# EAGLE design ERobot Minimalis - 2023 (EAGLE 9.6.2)
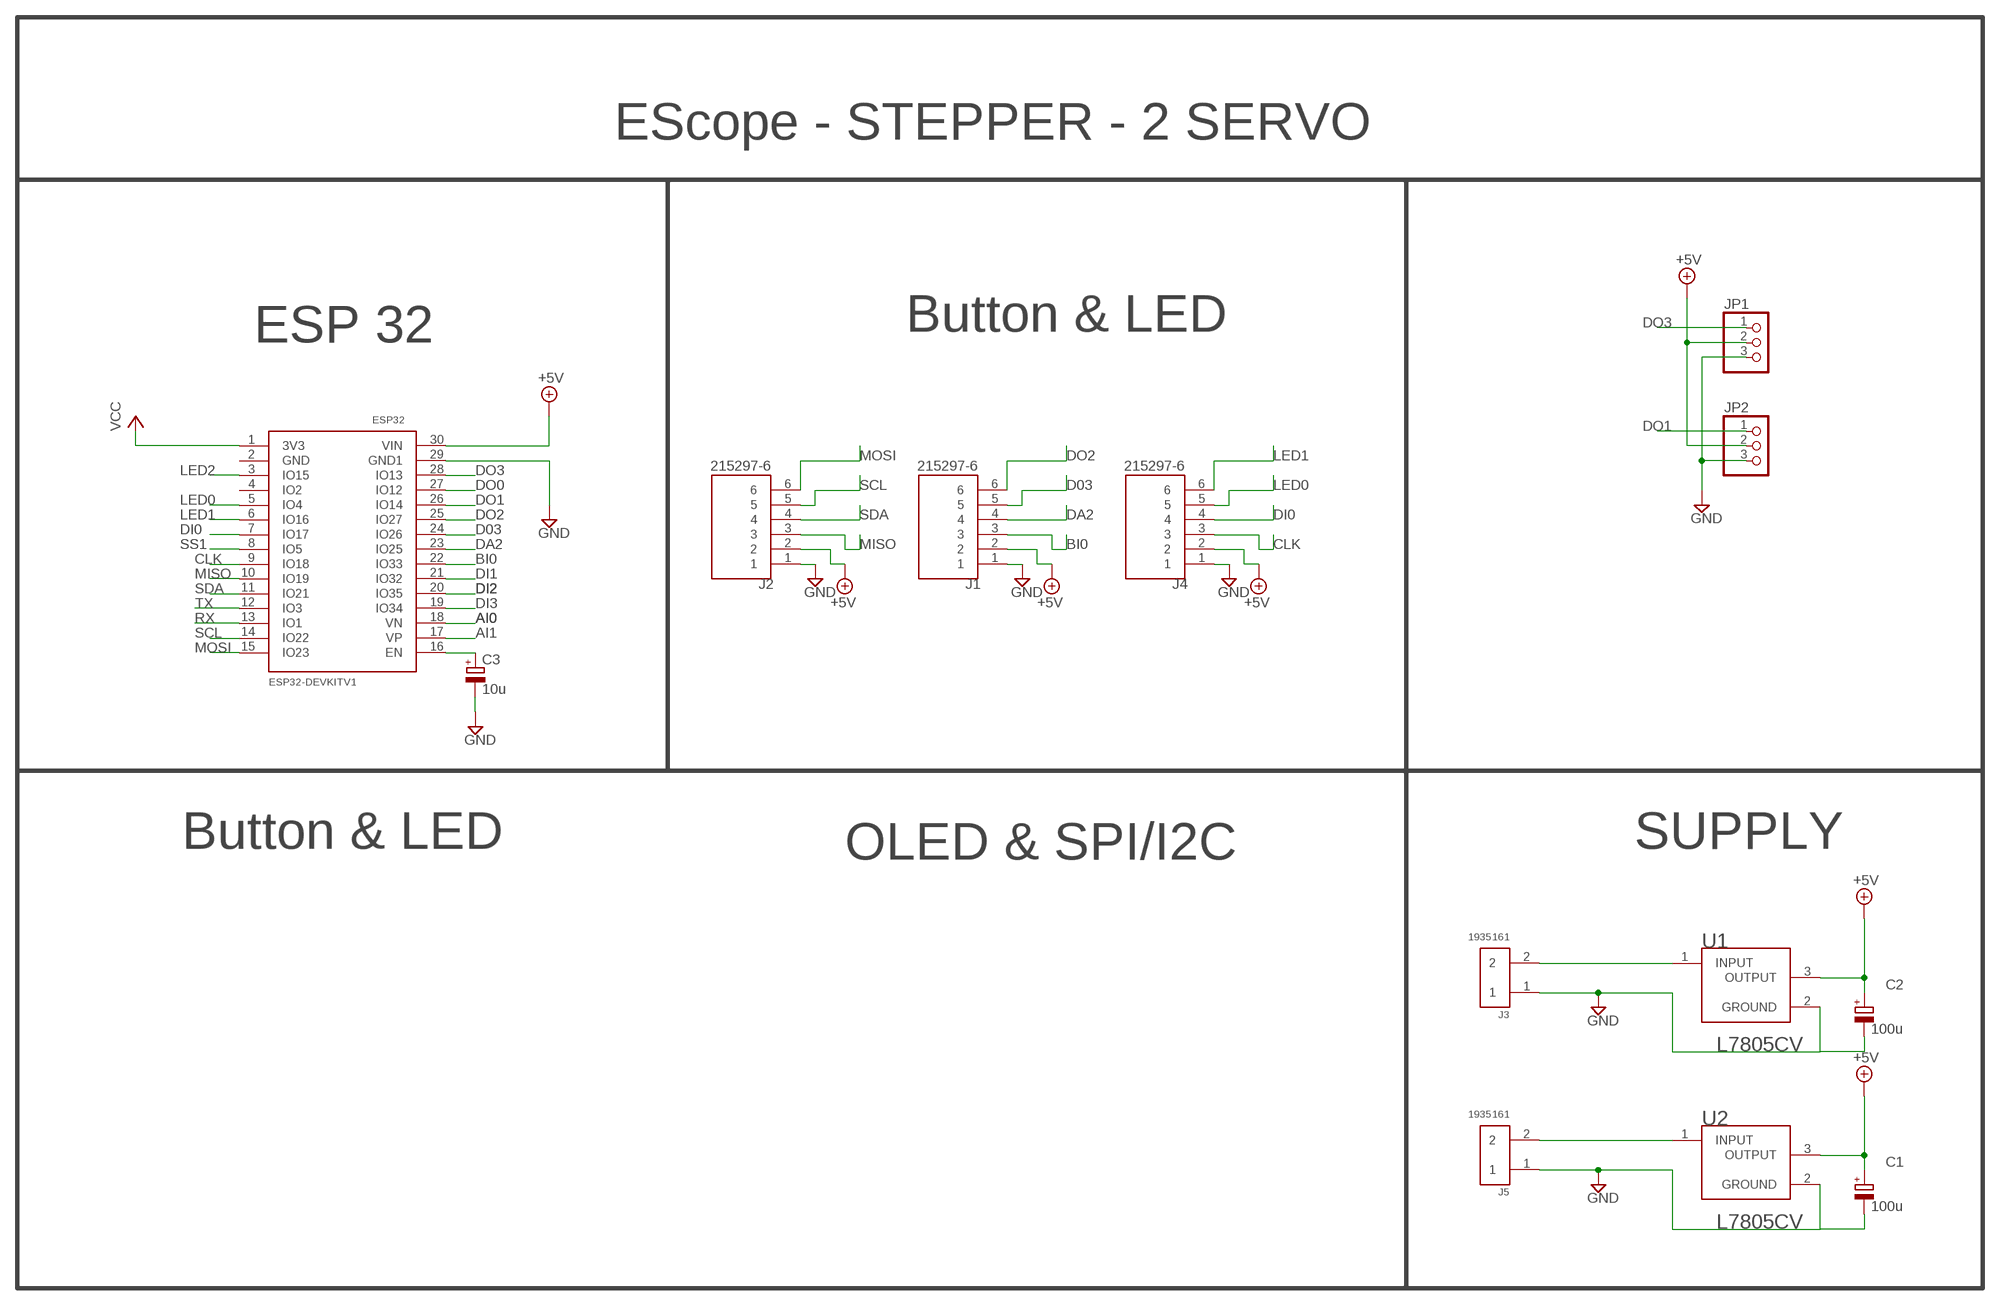
[diagram p0: schematic, sheet 1]

## Parts
C1  100u  CPOL-EUE3.5-8  [E3,5-8]
C2  100u  CPOL-EUE3.5-8  [E3,5-8]
C3  10u  CPOL-EUE2.5-5  [E2,5-5]
ESP32  DEVKIT-V1  ESP32DEVKITV1  [ESP32-DEVKITV1]
J1  215297-6  [TE_215297-6]
J2  215297-6  [TE_215297-6]
J3  1935161  [PHOENIX_1935161]
J4  215297-6  [TE_215297-6]
J5  1935161  [PHOENIX_1935161]
JP1  PINHD-1X3  [1X03]
JP2  PINHD-1X3  [1X03]
U1  STMICROELECTRONICS_L7805CVSTMICROELECTRONICS_L7805CV_0_0  [STMICROELECTRONICS_L7805CV_0]
U2  STMICROELECTRONICS_L7805CVSTMICROELECTRONICS_L7805CV_0_0  [STMICROELECTRONICS_L7805CV_0]

## Nets
+5V: C1.+ C2.+ ESP32.30(VIN) J1.2 J2.2 J4.2 JP1.2 JP2.2 U1.3(OUTPUT) U2.3(OUTPUT)
AI0: ESP32.18(VN)
AI1: ESP32.17(VP)
BI0: ESP32.22(IO33) J1.3
CLK: ESP32.9(IO18) J4.3
D03: ESP32.24(IO26) J1.5
DA2: ESP32.23(IO25) J1.4
DI0: ESP32.7(IO17) J4.4
DI1: ESP32.21(IO32)
DI2: ESP32.20(IO35)
DI3: ESP32.19(IO34)
DO0: ESP32.27(IO12)
DO1: ESP32.26(IO14) JP2.1
DO2: ESP32.25(IO27) J1.6
DO3: ESP32.28(IO13) JP1.1
GND: C1.- C2.- C3.- ESP32.29(GND1) J1.1 J2.1 J3.1 J4.1 J5.1 JP1.3 JP2.3 U1.2(GROUND) U2.2(GROUND)
LED0: ESP32.5(IO4) J4.5
LED1: ESP32.6(IO16) J4.6
LED2: ESP32.3(IO15)
MISO: ESP32.10(IO19) J2.3
MOSI: ESP32.15(IO23) J2.6
N$1: J5.2 U2.1(INPUT)
N$2: J3.2 U1.1(INPUT)
N$4: C3.+ ESP32.16(EN)
RX: ESP32.13(IO1)
SCL: ESP32.14(IO22) J2.5
SDA: ESP32.11(IO21) J2.4
SS1: ESP32.8(IO5)
TX: ESP32.12(IO3)
VCC: ESP32.1(3V3)
Unconnected: ESP32.2(GND) ESP32.4(IO2)

## Notes on the sheet
- EScope - STEPPER - 2 SERVO
- Button & LED
- ESP 32
- Button & LED | SUPPLY
- OLED & SPI/I2C

## Library data of the parts
C1-C3 = rcl:CPOL-EU: POLARIZED CAPACITOR, European symbol; SPICEPREFIX: C
ESP32 = ESP32-DEVKITV1:ESP32DEVKITV1
J1 J2 J4 = 215297-6:215297-6: Check availability <https://pricing.snapeda.com/parts/215297-6/TE%20Connectivity/view-part?ref=eda>; AVAILABILITY: In Stock; COMMENT: 215297-6; DESCRIPTION: Wire-To-Board Connector, Vertical, Ampmodu Hv-100 Series, Through Hole, Receptacle, 6, 2.54 Mm; EU_ROHS_COMPLIANCE: Compliant; MF: TE Connectivity; MP: 215297-6; PACKAGE: None; PRICE: None; PURCHASE-URL: https://pricing.snapeda.com/search/part/215297-6/?ref=eda
J3 J5 = 1935161:1935161: Conn Terminal Blocks 2 POS 5mm Solder ST Thru-Hole 16A Check availability <https://pricing.snapeda.com/parts/1935161/Phoenix%20Contact/view-part?ref=eda>; AVAILABILITY: In Stock; DESCRIPTION: 2 Position Wire to Board Terminal Block Horizontal with Board 0.197 (5.00mm) Through Hole; MF: Phoenix Contact; MP: 1935161; PACKAGE: None; PRICE: None; PURCHASE-URL: https://pricing.snapeda.com/search/part/1935161/?ref=eda
JP1 JP2 = pinhead:PINHD-1X3: PIN HEADER
U1 U2 = STMicroelectronics - L7805CV:STMICROELECTRONICS_L7805CV: Linear Voltage Regulator IC Positive Fixed 1 Output 5V 1.5A TO-220AB; CENTROID_NOT_SPECIFIED: No; DATASHEET: http://www.st.com/content/ccc/resource/technical/document/datasheet/41/4f/b3/b0/12/d4/47/88/CD00000444.pdf/files/CD00000444.pdf/jcr:content/translations/en.CD00000444.pdf; DIGIKEY_DESCRIPTION: IC REG LINEAR 5V 1.5A TO220AB; DIGIKEY_PART_NUMBER: 497-1443-5-ND; IPC_LAND_PATTERN_NAME: TO-220; LEAD_FREE: yes; MF: STMicroelectronics; MFG_PACKAGE_IDENT: TO-220-3; MOUSER_PART_NUMBER: 511-L7805CV; MPN: L7805CV; PACKAGE: TO-220-3; PREFIX: U; ROHS: yes; TEMPERATURE_RANGE_HIGH: +125°C; TEMPERATURE_RANGE_LOW: 0°C

## Board
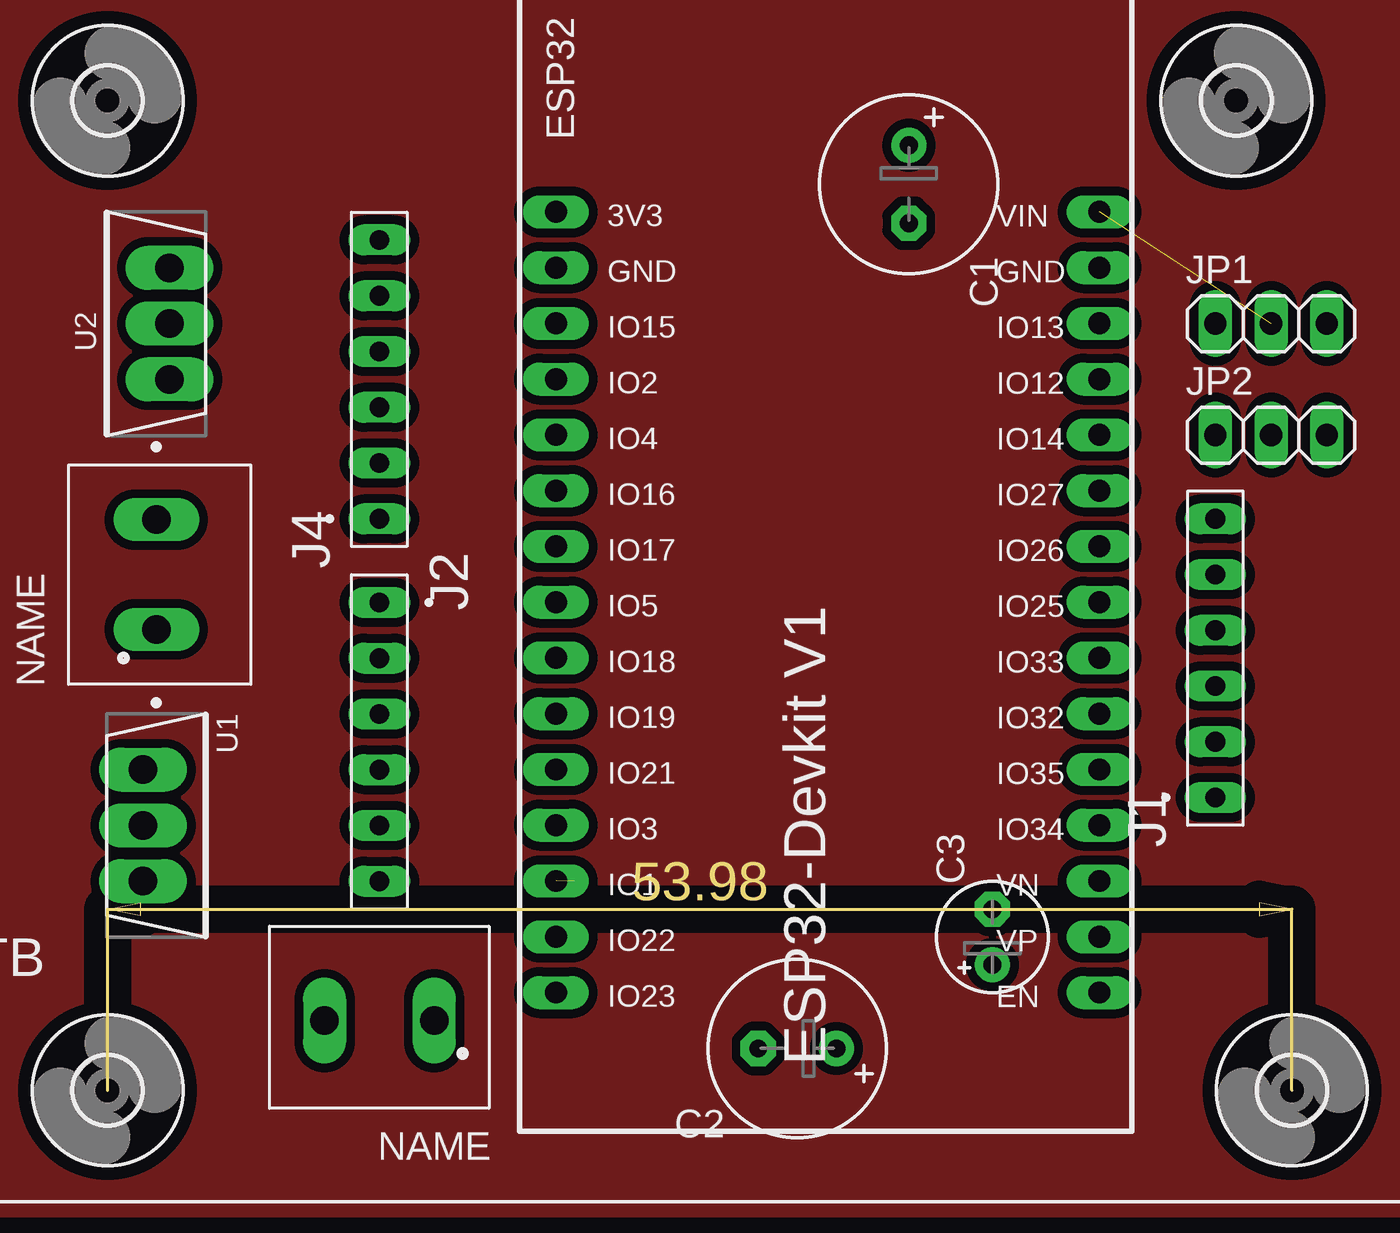
[diagram p1: board, top side]
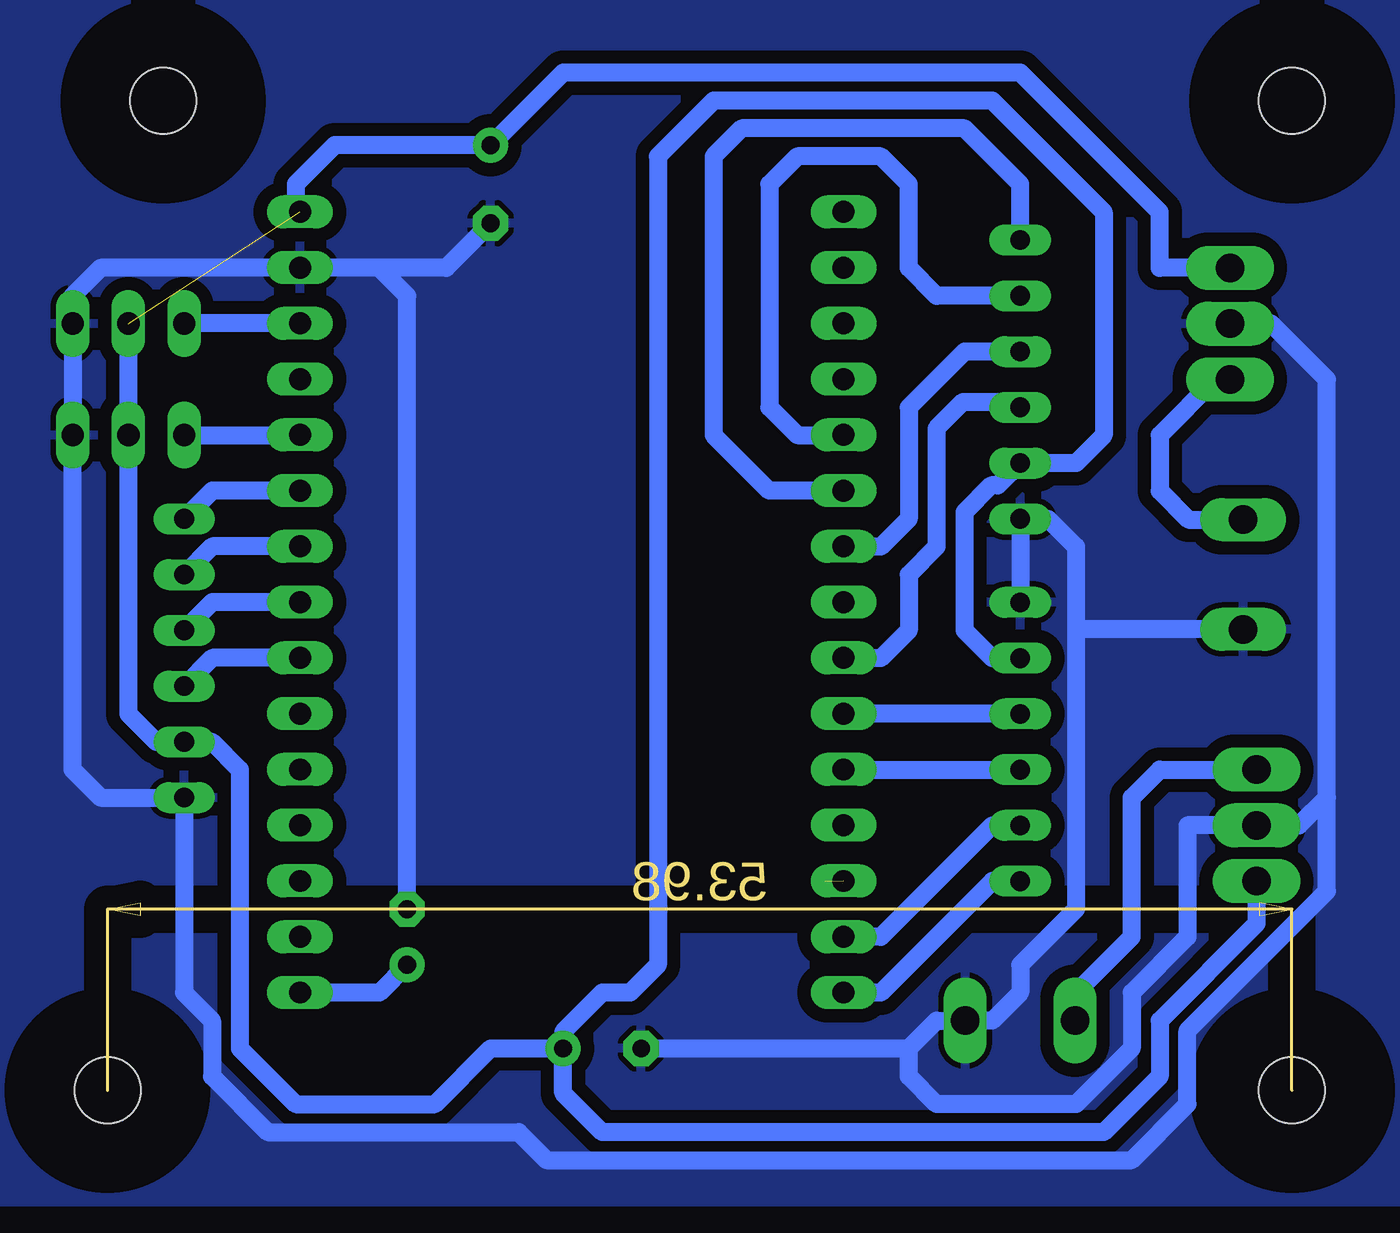
[diagram p2: board, bottom side, seen from below]

Size 53.98 x 8.56 mm. Coordinates in mm from the lower left corner, seen from the top.
Copper layers (1*16): Top 0.035mm / dielectric 1.5mm / Bottom 0.035mm
Design rules "default *": minimum track width 6mil, minimum drill 0.35mm, track to track 16mil, track to pad 16mil, pad to pad 16mil, via to via 16mil, smd to smd 16mil, copper to edge 40mil, drill to drill 6mil, minimum pad ring 10mil, minimum via ring 8mil, stop-mask expansion 4mil, vias tented up to drill 0mil, thermal gap 10mil

### Footprints (pad centres in the part's own frame; a part is rotated, then mirrored left to right if it is on the bottom)
E3,5-8 = drill 0.813 pad 1.6: + -1.778,0 | drill 0.813 pad 1.6 octagon: - 1.778,0
E2,5-5 = drill 0.813 pad 1.6: + -1.27,0 | drill 0.813 pad 1.6 octagon: - 1.27,0
ESP32-DEVKITV1 = drill 1 pad 1.422 long: 1 -22.87,-13.54; 2 -20.33,-13.54; 3 -17.79,-13.54; 4 -15.25,-13.54; 5 -12.71,-13.54; 6 -10.17,-13.54; 7 -7.63,-13.54; 8 -5.09,-13.54; 9 -2.55,-13.54; 10 -0.01,-13.54; 11 2.53,-13.54; 12 5.07,-13.54; 13 7.61,-13.54; 14 10.15,-13.54; 15 12.69,-13.54; 16 12.69,11.23; 17 10.15,11.23; 18 7.61,11.23; 19 5.07,11.23; 20 2.53,11.23; 21 -0.01,11.23; 22 -2.55,11.23; 23 -5.09,11.23; 24 -7.63,11.23; 25 -10.17,11.23; 26 -12.71,11.23; 27 -15.25,11.23; 28 -17.79,11.23; 29 -20.33,11.23; 30 -22.87,11.23
TE_215297-6 = drill 0.9 long: 1 -6.35,0; 2 -3.81,0; 3 -1.27,0; 4 1.27,0; 5 3.81,0; 6 6.35,0
PHOENIX_1935161 = drill 1.3 long: 1 -2.5,0; 2 2.5,0
1X03 = drill 1.016 long: 1 -2.54,0; 2 0,0; 3 2.54,0
STMICROELECTRONICS_L7805CV_0 = drill 1.3 pad 2 long: 1 -0.605,2.54; 2 -0.605,0; 3 -0.605,-2.54
3,0 = hole 3: 0,0

### Placement (x,y rotation side)
C1  36.51,41.28 270 top  (outside the outline)
C2  31.43,1.91 180 top
C3  40.32,6.98 90 top
ESP32  33.97,17.14 270 top
J1  50.48,19.68 90 top  (outside the outline)
J2  12.38,15.88 270 top
J3  12.38,3.18 180 top
J4  12.38,32.39 90 top  (outside the outline)
J5  2.22,23.5 90 top  (outside the outline)
JP1  53.02,34.92 0 top  (outside the outline)
JP2  53.02,29.85 0 top  (outside the outline)
U1  2.22,12.07 0 top
U2  2.22,34.92 180 top  (outside the outline)
U$2  [3,0]  51.44,45.08 0 top  (outside the outline)
U$3  [3,0]  53.98,0 0 top
U$4  [3,0]  0,0 0 top
U$5  [3,0]  0,45.08 0 top  (outside the outline)

### Tracks (layer width: path | path; a pad name or v marks a point on that pad's centre or on a via)
+5V  (1 unrouted)
  Bottom 0.813: J2.2 13.65,19.68 14.92,20.96 14.92,26.34 13.71,27.55 13.41,27.55 J4.2 9.84,28.57 8.57,29.85 8.57,40 13.65,45.08 26.35,45.08 28.89,42.55 28.89,5.71 30.16,4.45 31.43,4.45 33.21,2.67 C2.+ | JP1.2 JP2.2 53.02,17.14 51.75,15.88 J1.2 49.21,15.88 47.94,14.61 47.94,1.91 45.4,-0.63 39.05,-0.63 36.51,1.91 C2.+ | C2.+ 33.21,-0.13 31.43,-1.9 8.57,-1.9 6.03,0.63 6.03,3.18 1.62,7.59 U1.3 | U2.3 6.03,37.47 6.03,40 12.38,46.36 33.21,46.36 C1.+ 43.62,43.05 45.4,41.28 45.4,40.22 ESP32.30
BI0
  Bottom 0.813: ESP32.22 49.2,19.7 J1.3
CLK
  Bottom 0.813: J4.3 12.63,31.36 14.98,31.36 16.19,30.15 16.19,24.77 17.46,23.5 17.46,20.96 18.73,19.68 ESP32.9
D03
  Bottom 0.813: ESP32.24 49.2,24.77 J1.5
DA2
  Bottom 0.813: ESP32.23 49.2,22.23 J1.4
DI0
  Bottom 0.813: J4.4 14.92,33.66 17.46,31.11 17.46,26.04 18.73,24.77 ESP32.7
DO1
  Bottom 0.813: JP2.1 ESP32.26
DO2
  Bottom 0.813: ESP32.25 49.2,27.32 J1.6
DO3
  Bottom 0.813: ESP32.28 JP1.1
GND
  Bottom 0.813: J2.1 J4.1 11.11,26.04 9.84,24.77 9.84,20.96 | 9.84,20.96 9.84,8.26 12.38,5.71 12.38,4.45 13.65,3.18 J3.1 | J3.1 16.19,3.18 17.46,1.91 | 14.92,3.13 J3.1 | 41.59,37.47 40.32,36.19 C3.- | 41.59,37.47 ESP32.29 54.29,37.47 55.56,36.19 JP1.3 JP2.3 55.56,14.61 54.29,13.34 J1.1 50.48,4.45 49.21,3.18 49.21,0.63 46.67,-1.9 35.24,-1.9 33.97,-3.17 7.3,-3.17 4.76,-0.63 4.76,2.72 -1.59,9.07 -1.59,13.34 | C2.- 17.46,1.91 | -1.59,13.34 -1.59,32.39 0.95,34.92 U2.2 | -1.59,13.34 -0.32,12.07 U1.2 4.76,12.07 4.76,6.98 7.3,4.45 7.3,1.91 9.84,-0.63 16.19,-0.63 17.46,0.63 17.46,1.91 | C1.- 38.54,37.47 41.59,37.47 | J5.1 9.8,21 9.84,20.96
  pour Bottom (isolate 0.61): -5.4,51.44 59.37,51.44 59.37,-5.08 -5.4,-5.08
LED0
  Bottom 0.813: J4.5 16.19,36.19 17.46,37.47 17.46,41.28 18.73,42.55 22.54,42.55 23.81,41.28 23.81,31.11 22.54,29.85 ESP32.5
LED1
  Bottom 0.813: ESP32.6 23.82,27.32 26.35,29.85 26.35,42.55 25.08,43.81 14.92,43.81 12.38,41.28 J4.6
MISO
  Bottom 0.813: ESP32.10 J2.3
MOSI
  Bottom 0.813: J2.6 13.65,9.53 18.73,4.45 ESP32.15
N$1
  Bottom 0.813: U2.1 3.49,32.39 6.03,29.85 6.03,27.31 4.72,26 J5.2
N$2
  Bottom 0.813: J3.2 9.84,3.21 9.84,4.45 7.3,6.98 7.3,13.34 6.03,14.61 U1.1
N$3
  pour Top: -5.4,-5.71 59.37,-5.71 59.37,51.44 -5.4,51.44
N$4
  Bottom 0.813: ESP32.16 41.58,4.46 C3.+
RX  (1 unrouted)
  Bottom 0.813: 21.27,9.53 21.26,9.54
SCL
  Bottom 0.813: ESP32.14 18.73,6.98 13.65,12.07 J2.5
SDA
  Bottom 0.813: ESP32.11 J2.4

### Text on the board
tPlace: TF ITB